# EAGLE schematic micrcocontroller-ESP8266 (EAGLE 9.3.1)
COMPANY: ADAFRUIT INDUSTRIES; DRAWN: KTOWN; REV: B
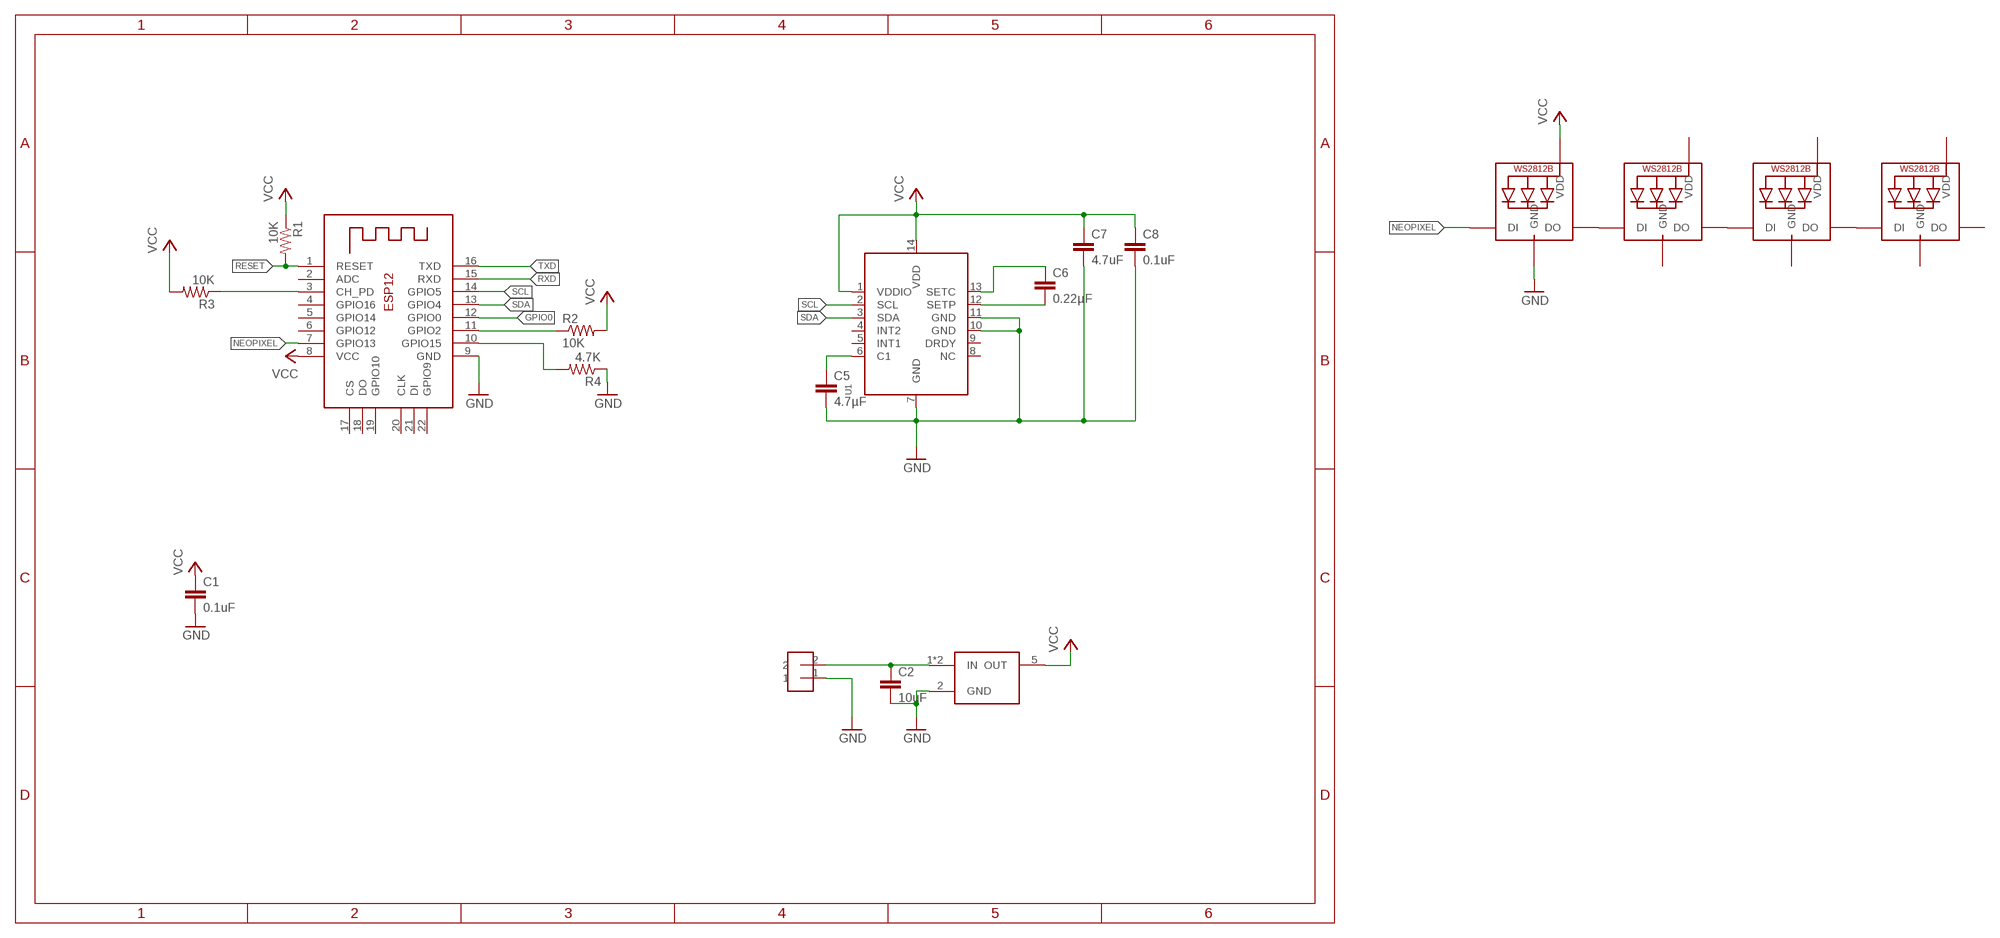
[diagram p0: schematic, sheet 1]

## Parts
C1  0.1uF  CAP0603-CAP  [0603-CAP]
C2  10uF  CAP0603-CAP  [0603-CAP]
C5  4.7µF  CAP0603-CAP  [0603-CAP]
C6  0.22µF  CAP0603-CAP  [0603-CAP]
C7  4.7uF  CAP0603-CAP  [0603-CAP]
C8  0.1uF  CAP0603-CAP  [0603-CAP]
LED1  NEOPIXEL_SK6812  [SK6812]
LED2  NEOPIXEL_SK6812  [SK6812]
LED3  NEOPIXEL_SK6812  [SK6812]
LED4  NEOPIXEL_SK6812  [SK6812]
R1  10K  RESISTOR0603  [0603-RES]
R2  10K  RESISTOR0603  [0603-RES]
R3  10K  RESISTOR0603  [0603-RES]
R4  4.7K  RESISTOR0603  [0603-RES]
U1  LSM303DLHC  [LGA14]
U$1  REGULATOR3.3V-0.5A-MIC5219  [SOT23-5]
U$2  HEADER-2-TESTPOINT  [TESTPOINT-2]
X2  ESP-12E  [ESP-12E]

## Nets
GND: C1.2 C2.2 C5.2 C7.2 C8.2 LED1.3-GND(GND) R4.1 U1.7(GND) U1.10(GND) U1.11(GND) U$1.2(GND) U$2.1 X2.9(GND)
GPIO0: X2.12(GPIO0)
N$1: R4.2 X2.10(GPIO15)
N$2: R3.1 X2.3(CH_PD)
N$3: C5.1 U1.6(C1)
N$4: C6.2 U1.12(SETP)
N$5: C6.1 U1.13(SETC)
N$6: R2.1 X2.11(GPIO2)
N$8: LED1.2-DOUT(DO) LED2.4-DIN(DI)
N$9: LED2.2-DOUT(DO) LED3.4-DIN(DI)
N$10: LED3.2-DOUT(DO) LED4.4-DIN(DI)
NEOPIXEL: LED1.4-DIN(DI) X2.7(GPIO13)
RESET: R1.2 X2.1(RESET)
RXD: X2.15(RXD)
SCL: U1.2(SCL) X2.14(GPIO5)
SDA: U1.3(SDA) X2.13(GPIO4)
TXD: X2.16(TXD)
VCC: C1.1 C7.1 C8.1 LED1.1-VDD(VDD) R1.1 R2.2 R3.2 U1.1(VDDIO) U1.14(VDD) U$1.5(OUT) X2.8(VCC)
VIN: C2.1 U$1.1(IN) U$1.3(IN) U$2.2
Unconnected: LED4.2-DOUT(DO) U1.4(INT2) U1.5(INT1) U1.8(NC) U1.9(DRDY) X2.2(ADC) X2.4(GPIO16) X2.5(GPIO14) X2.6(GPIO12) X2.17(CS) X2.18(DO) X2.19(GPIO10) X2.20(CLK) X2.21(DI) X2.22(GPIO9)

## Power pins joined to a net without a drawn wire
GND: LED2.3-GND(GND) LED3.3-GND(GND) LED4.3-GND(GND)
VDD: LED2.1-VDD(VDD) LED3.1-VDD(VDD) LED4.1-VDD(VDD)

## Library data of the parts
C1 C2 C5-C8 = homemade-hardware:CAP: Capacitor Standard 0603 ceramic capacitor, and 0.1" leaded capacitor.
LED1-LED4 = homemade-hardware:NEOPIXEL_SK6812: SK6812 <https://www.digikey.com/product-detail/en/adafruit-industries-llc/1655/1528-1104-ND/5154679>: NeoPixel Addressable LED
R1-R4 = homemade-hardware:RESISTOR: Resistor Basic schematic elements and footprints for 0603, 1206, and PTH resistors.
U1 = microbuilder:LSM303DLHC: LSM303DLHC 3-Axis I2C Accelerometer and 3-Axis Magnetometer VDD: 2.2-3.6V VDDIO: 1.8-VDD Magnetic Range: +/-1.3 to +/-8.1 gauss Accel Range: +/-2/4/8/16 g Temp: -40 - 85°C
U$1 = homemade-hardware:REGULATOR: MC7805CTG <https://www.digikey.com/product-detail/en/on-semiconductor/MC7805CTG/MC7805CTGOS-ND/919333>: 5V/1A DIP Linear Regulator UA78M33CDCYR <https://www.digikey.com/product-detail/en/texas-instruments/UA78M33CDCYR/296-13424-1-ND/484495>: 3.3V/0.5A SMD Linear Regulator MIC5219-5.0YM5-TR <https://www.digikey.com/products/en/integrated-circuits-ics/pmic-voltage-regulators-linear/699?k=MIC5219-5.0YM5-TR&k=&pkeyword=MIC5219-5.0YM5-TR&sv=0&pv7=2&sf=0&quantity=&ColumnSort=0&page=1&pageSize=25>: 5V/0.5A SMD Linear Regulator MIC5219-3.3YM5-TR <https://www.digikey.com/products/en/integrated-circuits-ics/pmic-voltage-regulators-linear/699?k=MIC5219-3.3YM5-TR&k=&pkeyword=MIC5219-3.3YM5-TR&sv=0&pv7=2&sf=0&quantity=&ColumnSort=0&page=1&pageSize=25>: 3.3V/0.5A SMD Linear Regulator
U$2 = homemade-hardware:HEADER-2
X2 = homemade-hardware:ESP-12E: ESP-12 Module <https://www.digikey.com/products/en/rf-if-and-rfid/rf-transceiver-modules/872?k=esp-12>: Contains ESP8266 WiFi microcontroller (from Adafruit Huzzah)